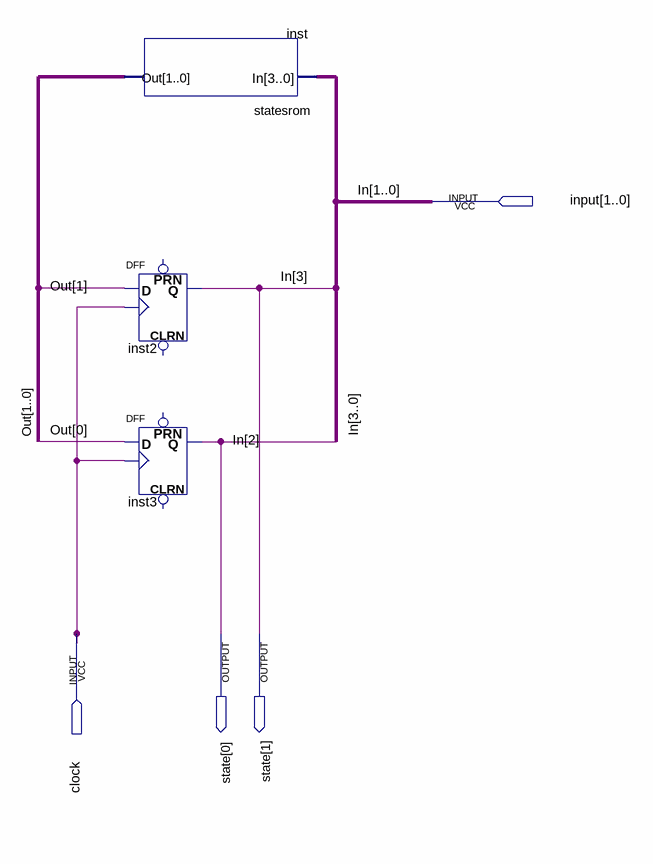
[diagram p0: schematic sheet]
// Quartus schematic statesmach.bdf as structural Verilog: 3 symbols, 4 pins
module statesmach (
  input  [1:0] \input ,
  input  clock,
  output [1:0] state
);

  wire [1:0] Out;

  statesrom inst (.In({state, \input }), .Out(Out));
  DFF inst2 (.CLK(clock), .D(Out[1]), .Q(state[1]));  // open: CLRN, PRN
  DFF inst3 (.CLK(clock), .D(Out[0]), .Q(state[0]));  // open: CLRN, PRN

  // Other names for the same wires on the sheet: In[3:0] = {state, \input }
endmodule
